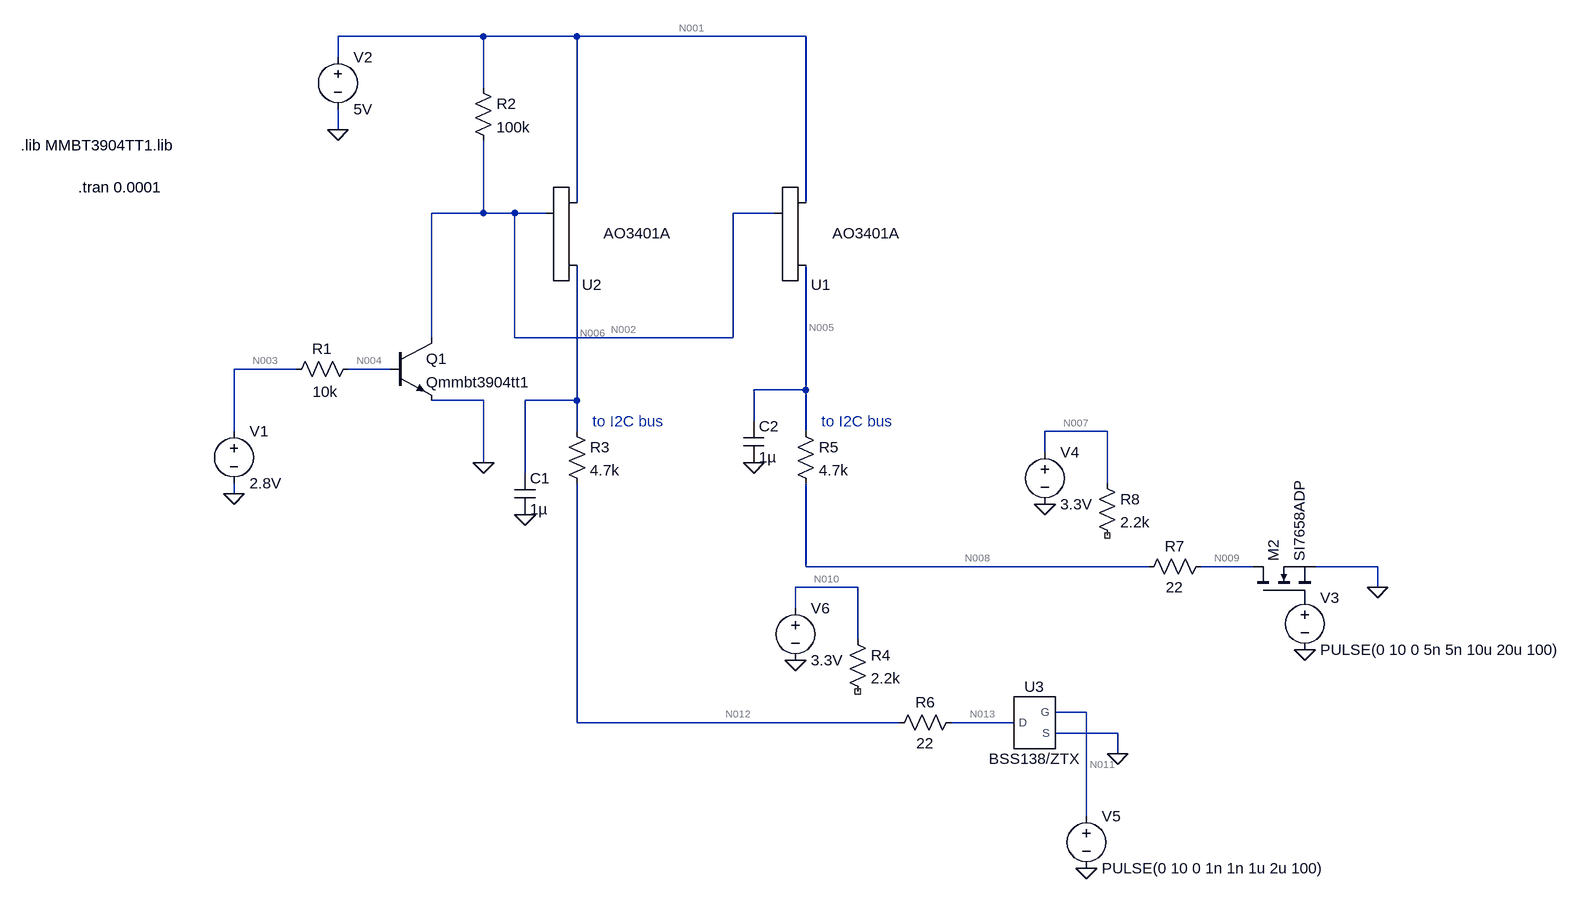
[diagram p0: schematic I2C_External_Bi.asc]
I2C_External_Bi.asc, the LTspice schematic file:
Version 4
SHEET 1 2076 1092
WIRE 384 -304 160 -304
WIRE 528 -304 384 -304
WIRE 880 -304 528 -304
WIRE 160 -272 160 -304
WIRE 384 -224 384 -304
WIRE 160 -160 160 -192
WIRE 528 -48 528 -304
WIRE 880 -48 880 -304
WIRE 384 -32 384 -144
WIRE 384 -32 304 -32
WIRE 432 -32 384 -32
WIRE 480 -32 432 -32
WIRE 832 -32 768 -32
WIRE 304 160 304 -32
WIRE 432 160 432 -32
WIRE 768 160 768 -32
WIRE 768 160 432 160
WIRE 96 208 0 208
WIRE 240 208 176 208
WIRE 880 240 880 48
WIRE 880 240 800 240
WIRE 384 256 304 256
WIRE 528 256 528 48
WIRE 528 256 448 256
WIRE 800 288 800 240
WIRE 0 304 0 208
WIRE 528 304 528 256
WIRE 880 304 880 240
WIRE 1344 304 1248 304
WIRE 1248 336 1248 304
WIRE 384 352 384 256
WIRE 448 368 448 256
WIRE 1344 384 1344 304
WIRE 0 400 0 384
WIRE 880 512 880 384
WIRE 1408 512 880 512
WIRE 1568 512 1488 512
WIRE 1760 512 1664 512
WIRE 960 544 864 544
WIRE 1760 544 1760 512
WIRE 864 576 864 544
WIRE 960 624 960 544
WIRE 1312 736 1264 736
WIRE 528 752 528 384
WIRE 1024 752 528 752
WIRE 1200 752 1104 752
WIRE 1360 768 1264 768
WIRE 1360 800 1360 768
WIRE 1312 896 1312 736
FLAG 0 400 0
FLAG 160 -160 0
FLAG 384 352 0
FLAG 1760 544 0
FLAG 1648 640 0
FLAG 1248 416 0
FLAG 1360 800 0
FLAG 1312 976 0
FLAG 864 656 0
FLAG 448 432 0
FLAG 800 352 0
SYMBOL voltage 0 288 R0
WINDOW 123 0 0 Left 0
WINDOW 39 0 0 Left 0
SYMATTR InstName V1
SYMATTR Value 2.8V
SYMBOL res 192 192 R90
WINDOW 0 0 56 VBottom 2
WINDOW 3 35 51 VTop 2
SYMATTR InstName R1
SYMATTR Value 10k
SYMBOL res 368 -240 R0
SYMATTR InstName R2
SYMATTR Value 100k
SYMBOL voltage 160 -288 R0
WINDOW 123 0 0 Left 0
WINDOW 39 0 0 Left 0
SYMATTR InstName V2
SYMATTR Value 5V
SYMBOL res 512 288 R0
SYMATTR InstName R3
SYMATTR Value 4.7k
SYMBOL AO3401A 560 16 M180
WINDOW 3 61 1 Top 2
SYMATTR InstName U2
SYMBOL npn 240 160 R0
SYMATTR InstName Q1
SYMATTR Value Qmmbt3904tt1
SYMBOL res 864 288 R0
SYMATTR InstName R5
SYMATTR Value 4.7k
SYMBOL AO3401A 912 16 M180
WINDOW 3 61 1 Top 2
SYMATTR InstName U1
SYMBOL res 1328 368 R0
SYMATTR InstName R8
SYMATTR Value 2.2k
SYMBOL voltage 1248 320 R0
SYMATTR InstName V4
SYMATTR Value 3.3V
SYMBOL voltage 1312 880 R0
WINDOW 123 0 0 Left 0
WINDOW 39 0 0 Left 0
SYMATTR InstName V5
SYMATTR Value PULSE(0 10 0 1n 1n 1u 2u 100)
SYMBOL res 944 608 R0
SYMATTR InstName R4
SYMATTR Value 2.2k
SYMBOL voltage 864 560 R0
SYMATTR InstName V6
SYMATTR Value 3.3V
SYMBOL voltage 1648 544 R0
WINDOW 123 0 0 Left 0
WINDOW 39 0 0 Left 0
SYMATTR InstName V3
SYMATTR Value PULSE(0 10 0 5n 5n 10u 20u 100)
SYMBOL nmos 1568 560 R270
SYMATTR InstName M2
SYMATTR Value SI7658ADP
SYMBOL res 1120 736 R90
WINDOW 0 0 56 VBottom 2
WINDOW 3 32 56 VTop 2
SYMATTR InstName R6
SYMATTR Value 22
SYMBOL res 1504 496 R90
WINDOW 0 0 56 VBottom 2
WINDOW 3 32 56 VTop 2
SYMATTR InstName R7
SYMATTR Value 22
SYMBOL BSS138_ZTX 1232 752 R0
SYMATTR InstName U3
SYMBOL cap 432 368 R0
SYMATTR InstName C1
SYMATTR Value 1µ
SYMBOL cap 784 288 R0
SYMATTR InstName C2
SYMATTR Value 1µ
TEXT 552 288 Left 2 ;to I2C bus
TEXT -240 -72 Left 2 !.tran 0.0001
TEXT -328 -136 Left 2 !.lib MMBT3904TT1.lib
TEXT 904 288 Left 2 ;to I2C bus

The netlist it stands for:
* I2C_External_Bi.asc
V1 N003 0 2.8V
R1 N004 N003 10k
R2 N001 N002 100k
V2 N001 0 5V
R3 N006 N012 4.7k
XU2 N006 N002 N001 AO3401A
Q1 N002 N004 0 0 Qmmbt3904tt1
R5 N005 N008 4.7k
XU1 N005 N002 N001 AO3401A
R8 N007 NC_01 2.2k
V4 N007 0 3.3V
V5 N011 0 PULSE(0 10 0 1n 1n 1u 2u 100)
R4 N010 NC_02 2.2k
V6 N010 0 3.3V
V3 P001 0 PULSE(0 10 0 5n 5n 10u 20u 100)
M2 N009 P001 0 0 SI7658ADP
R6 N013 N012 22
R7 N009 N008 22
XU3 N013 N011 0 BSS138/ZTX  ; pins D G S
C1 N006 0 1µ
C2 N005 0 1µ
.model NPN NPN
.model PNP PNP
.lib standard.bjt
.model NMOS NMOS
.model PMOS PMOS
.lib standard.mos
* to I2C bus
.tran 0.0001
.lib MMBT3904TT1.lib
* to I2C bus
.lib AO3401A.mod
.lib BSS138.lib
.backanno
.end

* Results of the author's LTspice run, read from the files saved beside the schematic
* Operating Point, zero values left out:
*   V(n003) = 2.8 V
*   V(n004) = 569.6 mV
*   V(n001) = 5 V
*   V(n002) = -20.93 mV
*   V(n006) = 5 V
*   V(n012) = 4.996 V
*   V(n005) = 5 V
*   V(n008) = 5 V
*   V(n007) = 3.3 V
*   V(n010) = 3.3 V
*   V(n009) = 5 V
*   V(n013) = 4.996 V
*   Ic(Q1) = 50.21 µA
*   Ib(Q1) = 223 µA
*   Ie(Q1) = -273.2 µA
*   Id(M2) = 53.15 pA
*   Is(M2) = -53.15 pA
*   I(R7) = -63.61 pA
*   I(R6) = -832.7 nA
*   I(R5) = 63.61 pA
*   I(R3) = 832.7 nA
*   I(R2) = 50.21 µA
*   I(R1) = -223 µA
*   I(V5) = 5.006 pA
*   I(V2) = -51.04 µA
*   I(V1) = -223 µA
*   Ix(u2:4) = -832.7 nA
*   Ix(u2:2) = 832.7 nA
*   Ix(u1:4) = -63.58 pA
*   Ix(u1:2) = 57.73 pA
*   Ix(u3:3) = 832.7 nA
*   Ix(u3:4) = -5.006 pA
*   Ix(u3:5) = -832.7 nA
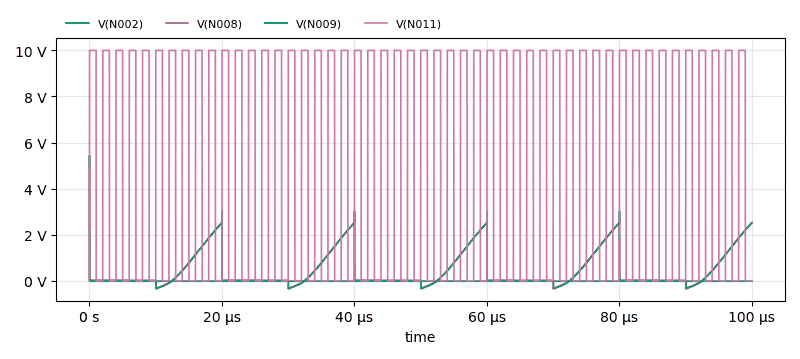
[diagram p1: Transient Analysis of I2C_External_Bi.asc, plotted from the saved traces]
* Transient Analysis, 1 run:
*   V(N002): min -20.94 mV, max -20.92 mV, average -20.93 mV, rms 20.93 mV, last -20.92 mV
*   V(N008): min -323.8 mV, max 5.427 V, average 455.8 mV, rms 892.9 mV, last 2.529 V
*   V(N009): min -348.7 mV, max 5.429 V, average 434.5 mV, rms 885.3 mV, last 2.517 V
*   V(N011): min 0 V, max 10 V, average 5.005 V, rms 7.073 V, last 0 V